# Altium schematic sheet MainBoardSTM32.SchDoc
size A4
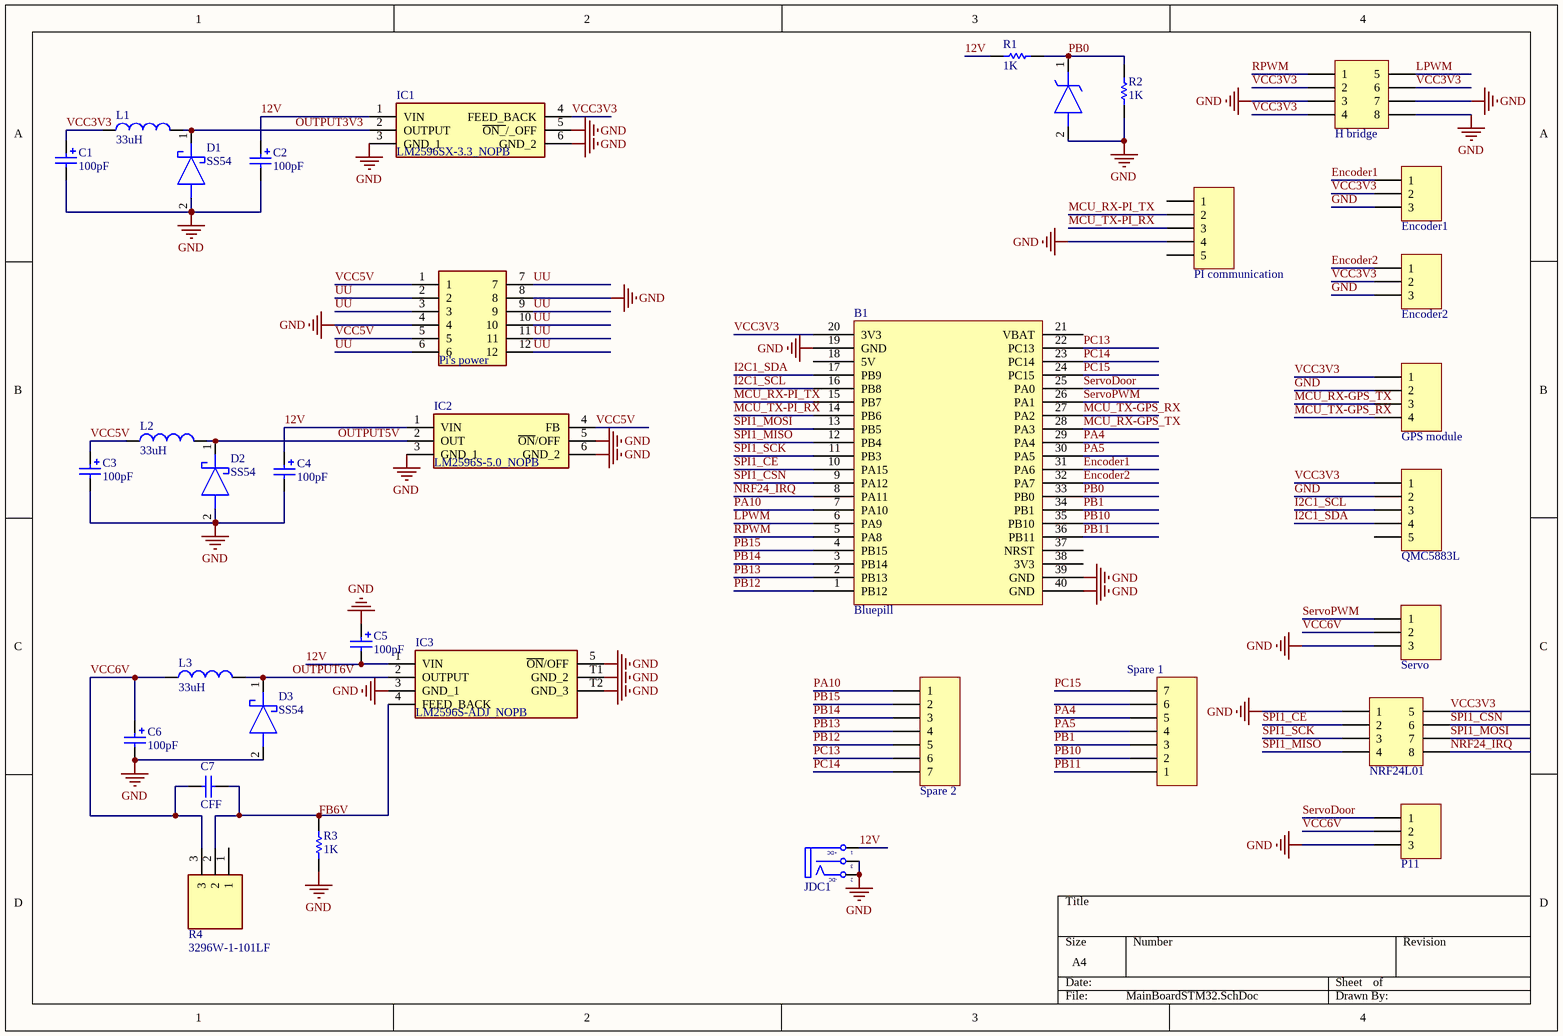
[diagram p0: MainBoardSTM32.SchDoc]

## Parts
B1  Bluepill  [Bluepill]
C1  value 100pF  [CP1/2.5]  (hidden comment: Cap Pol)
C2  value 100pF  [CP1.5/3.4]  (hidden comment: Cap Pol)
C3  value 100pF  [CP1/2.5]  (hidden comment: Cap Pol)
C4  value 100pF  [CP1.5/3.4]  (hidden comment: Cap Pol)
C5  value 100pF  [CP1.5/3.4]  (hidden comment: Cap Pol)
C6  value 100pF  [CP1/2.5]  (hidden comment: Cap Pol)
C7  CFF  [CAP-SM-0805]
D1  SS54  [DIOM5026X262N]
D2  SS54  [DIOM5026X262N]
D3  SS54  [DIOM5026X262N]
IC1  LM2596SX-3.3_NOPB  [KTT0005B]
IC2  LM2596S-5.0_NOPB  [KTT0005B]
IC3  LM2596S-ADJ_NOPB  [LM2596SXADJ]
J1  Pi's power  [MOLEX-DUALUSB]
JDC1  Jack DC  [DC-IN]  (value not drawn)
L1  value 33uH  [INDUCTOR 12.5x12.5]  (hidden comment: Inductor)
L2  value 33uH  [INDUCTOR 12.5x12.5]  (hidden comment: Inductor)
L3  value 33uH  [INDUCTOR 12.5x12.5]  (hidden comment: Inductor)
P1  H bridge  [JP4x2]
P2  Encoder1  [JP3]
P3  PI communication  [JP5]
P4  Encoder2  [JP3]
P5  GPS module  [JP4]
P6  QMC5883L  [JP5]
P7  Servo  [JP3]
P8  NRF24L01  [JP4x2]
P9  Spare 2  [JP7H]
P10  Spare 1  [JP7H]
P11  Header 3  [JP3]  (value not drawn)
R1  value 1K  [RES-SM-0603]  (hidden comment: RESISTOR SMD)
R2  value 1K  [RES-SM-0603]  (hidden comment: RESISTOR SMD)
R3  value 1K  [RES-SM-0805]  (hidden comment: RESISTOR SMD)
R4  3296W-1-101LF  [3296W-1]
Z1  1N4728ATR  [DIOAD1413W86L463D238]  (value not drawn)

## Nets
GND: B1.19(GND) B1.39(GND) B1.40(GND) C1.2 C2.2 C3.2 C4.2 C5.1 C6.2 D1.2(A) D2.2(A) D3.2(A) IC1.3(GND_1) IC1.5(~{ON_}/_OFF) IC1.6(GND_2) IC2.3(GND_1) IC2.5(~{ON}/OFF) IC2.6(GND_2) IC3.3(GND_1) IC3.5(~{ON}/OFF) IC3.T1(GND_2) IC3.T2(GND_3) J1.4 J1.8 JDC1.2(TN) JDC1.3(S) P1.3 P1.7 P1.8 P2.3 P3.4 P4.3 P5.2 P6.2 P7.3 P8.1 P11.3 R2.2 R3.2 Z1.2(A)
12V: C2.1 C4.1 C5.2 IC1.1(VIN) IC2.1(VIN) IC3.1(VIN) JDC1.1(T) R1.1
Encoder1: B1.31(PA6) P2.1
Encoder2: B1.32(PA7) P4.1
FB6V: C7.2 IC3.4(FEED_BACK) R3.1 R4.2
I2C1_SCL: B1.16(PB8) P6.3
I2C1_SDA: B1.17(PB9) P6.4
LPWM: B1.6(PA9) P1.5
MCU_RX-GPS_TX: B1.28(PA3) P5.3
MCU_RX-PI_TX: B1.15(PB7) P3.2
MCU_TX-GPS_RX: B1.27(PA2) P5.4
MCU_TX-PI_RX: B1.14(PB6) P3.3
NRF24_IRQ: B1.8(PA11) P8.8
OUTPUT3V3: D1.1(K) IC1.2(OUTPUT) L1.2
OUTPUT5V: D2.1(K) IC2.2(OUT) L2.2
OUTPUT6V: D3.1(K) IC3.2(OUTPUT) L3.2
PA4: B1.29(PA4) P10.5
PA5: B1.30(PA5) P10.4
PA10: B1.7(PA10) P9.1
PB0: B1.33(PB0) R1.2 R2.1 Z1.1(K)
PB1: B1.34(PB1) P10.3
PB10: B1.35(PB10) P10.2
PB11: B1.36(PB11) P10.1
PB12: B1.1(PB12) P9.5
PB13: B1.2(PB13) P9.4
PB14: B1.3(PB14) P9.3
PB15: B1.4(PB15) P9.2
PC13: B1.22(PC13) P9.6
PC14: B1.23(PC14) P9.7
PC15: B1.24(PC15) P10.7
RPWM: B1.5(PA8) P1.1
ServoDoor: B1.25(PA0) P11.1
ServoPWM: B1.26(PA1) P7.1
SPI1_CE: B1.10(PA15) P8.2
SPI1_CSN: B1.9(PA12) P8.6
SPI1_MISO: B1.12(PB4) P8.4
SPI1_MOSI: B1.13(PB5) P8.7
SPI1_SCK: B1.11(PB3) P8.3
UU: J1.2 J1.3 J1.6 J1.7 J1.9 J1.10 J1.11 J1.12
VCC3V3: B1.20(3V3) C1.1 IC1.4(FEED_BACK) L1.1 P1.2 P1.4 P1.6 P2.2 P4.2 P5.1 P6.1 P8.5
VCC5V: C3.1 IC2.4(FB) J1.1 J1.5 L2.1
VCC6V: C6.1 C7.1 L3.1 P7.2 P11.2 R4.3

Not connected (* = marked no-connect by the designer): B1 18(5V) 21(VBAT) 37(NRST) 38(3V3); P3 1 5; P6 5; P10 6; R4 1

## Notes on the sheet
- (in symbol Jack DC) +DC; -DC

## Library data of the parts
C1-C6 = Cap Pol: Polarized Capacitor (Radial)
C7 = Cap Non-Pol SMD: Capacitor; Value: 680uF
D1-D3 = SS54: Schottky Diode; Manufacturer_Name: DIYI Elec Tech; Datasheet Link: https://datasheet.lcsc.com/szlcsc/DIYI-Elec-Tech-SS54_C84165.pdf; Height: 2.62mm; Manufacturer_Part_Number: SS54
IC1 = LM2596SX-3.3_NOPB: Integrated Circuit; Manufacturer_Name: Texas Instruments; Manufacturer_Part_Number: LM2596SX-3.3/NOPB; Datasheet Link: http://www.ti.com/lit/gpn/lm2596; Mouser Part Number: 926-LM2596SX33NOPB; Mouser Price/Stock: https://www.mouser.co.uk/ProductDetail/Texas-Instruments/LM2596SX-33-NOPB?qs=X1J7HmVL2ZEm4UYTFC0WWA%3D%3D; Arrow Part Number: LM2596SX-3.3/NOPB; Arrow Price/Stock: https://www.arrow.com/en/products/lm2596sx-3.3nopb/texas-instruments?region=nac
IC2 = LM2596S-5.0_NOPB: Integrated Circuit; Manufacturer_Name: Texas Instruments; Manufacturer_Part_Number: LM2596S-5.0/NOPB; Datasheet Link: https://www.ti.com/lit/gpn/LM2596; Mouser Part Number: 926-LM2596S-5.0/NOPB; Mouser Price/Stock: https://www.mouser.co.uk/ProductDetail/Texas-Instruments/LM2596S-50-NOPB?qs=X1J7HmVL2ZHVjCOmW%252BYINA%3D%3D; Arrow Part Number: LM2596S-5.0/NOPB; Arrow Price/Stock: https://www.arrow.com/en/products/lm2596s-5.0nopb/texas-instruments?region=nac
IC3 = LM2596S-ADJ_NOPB: Integrated Circuit; Manufacturer_Name: Texas Instruments; Manufacturer_Part_Number: LM2596S-ADJ/NOPB; Datasheet Link: https://www.ti.com/lit/ds/symlink/lm2596.pdf?HQS=ti-null-null-sf-df-pf-sep-wwe&ts=1592978195629; Height: 4.57mm; Mouser Part Number: 926-LM2596S-ADJ/NOPB; Mouser Price/Stock: https://www.mouser.co.uk/ProductDetail/Texas-Instruments/LM2596S-ADJ-NOPB?qs=X1J7HmVL2ZHoMN0DLDcNog%3D%3D; Arrow Part Number: LM2596S-ADJ/NOPB; Arrow Price/Stock: https://www.arrow.com/en/products/lm2596s-adjnopb/texas-instruments?region=nac
J1 = 67298-3090: Connector; Manufacturer_Name: Molex; Datasheet Link: https://datasheet.datasheetarchive.com/originals/distributors/Datasheets_SAMA/769e69235f305794a0165724e99951b5.pdf; Manufacturer_Part_Number: 67298-3090; Mouser Part Number: 538-67298-3090; Mouser Price/Stock: https://www.mouser.co.uk/ProductDetail/Molex/67298-3090?qs=x6EjVpvqMVOYHaae5plDDQ%3D%3D
JDC1 = Jack DC: Jack DC input; Value: Jac DC
P1 P8 = Header 4X2: Header, 4-Pin, Dual row; LatestRevisionDate: 17-Jul-2002; LatestRevisionNote: Re-released for DXP Platform.; Publisher: Altium Limited
P2 P4 P7 P11 = Header 3: Header, 3-Pin; LatestRevisionDate: 17-Jul-2002; LatestRevisionNote: Re-released for DXP Platform.; Publisher: Altium Limited
P3 P6 = Header 5: Header, 5-Pin; LatestRevisionDate: 17-Jul-2002; LatestRevisionNote: Re-released for DXP Platform.; Publisher: Altium Limited
P5 = Header 4: Header, 4-Pin; LatestRevisionDate: 17-Jul-2002; LatestRevisionNote: Re-released for DXP Platform.; Publisher: Altium Limited
P9 P10 = Header 7H: Header, 7-Pin, Right Angle; LatestRevisionDate: 17-Jul-2002; LatestRevisionNote: Re-released for DXP Platform.; Publisher: Altium Limited
R1-R3 = RESISTOR SMD: Resistor
R4 = 3296W-1-101LF: Resistor; Manufacturer_Name: Bourns; Datasheet Link: https://www.bourns.com/pdfs/3296.pdf; Manufacturer_Part_Number: 3296W-1-101LF; Mouser Part Number: 652-3296W-1-101LF; Mouser Price/Stock: https://www.mouser.co.uk/ProductDetail/Bourns/3296W-1-101LF?qs=UcU9LKO1dwEefwKxVJG4Jw%3D%3D; Arrow Part Number: 3296W-1-101LF; Arrow Price/Stock: https://www.arrow.com/en/products/3296w-1-101lf/bourns?region=nac
Z1 = 1N4728ATR: Zener Diode; Manufacturer_Name: onsemi; Datasheet Link: http://www.onsemi.com/pub/Collateral/1N4736AT-D.PDF; Manufacturer_Part_Number: 1N4728ATR; Mouser Part Number: 512-1N4728ATR; Mouser Price/Stock: https://www.mouser.co.uk/ProductDetail/ON-Semiconductor-Fairchild/1N4728ATR?qs=2V4k6Hs0nQm1Vo9UQ1sIIw%3D%3D; Arrow Part Number: 1N4728ATR; Arrow Price/Stock: https://www.arrow.com/en/products/1n4728atr/on-semiconductor?region=nac